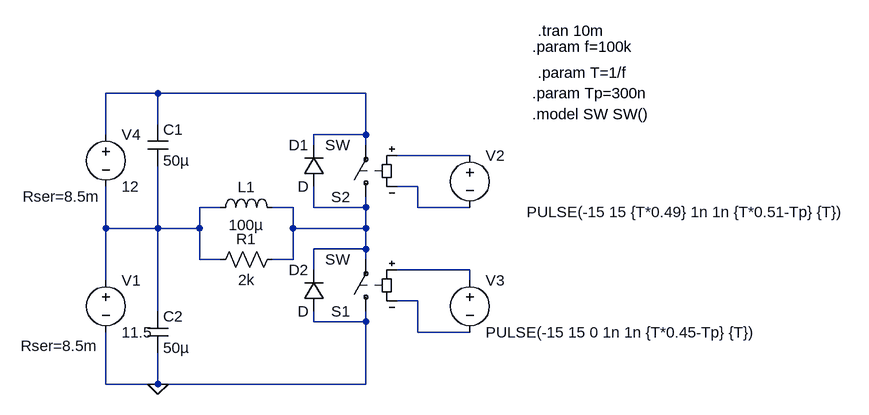
[diagram p0: schematic Draft1.asc]
Draft1.asc, the LTspice schematic file:
Version 4
SHEET 1 1116 680
WIRE -16 -64 -96 -64
WIRE 304 -64 -16 -64
WIRE -16 -16 -16 -64
WIRE -96 0 -96 -64
WIRE 304 0 304 -64
WIRE 304 0 224 0
WIRE 224 16 224 0
WIRE 304 16 304 0
WIRE 464 32 352 32
WIRE 384 80 352 80
WIRE 80 112 48 112
WIRE 192 112 160 112
WIRE 224 112 224 80
WIRE 304 112 304 96
WIRE 304 112 224 112
WIRE 384 112 384 80
WIRE 464 112 384 112
WIRE -96 144 -96 80
WIRE -16 144 -16 48
WIRE -16 144 -96 144
WIRE 48 144 48 112
WIRE 48 144 -16 144
WIRE 192 144 192 112
WIRE 304 144 304 112
WIRE 304 144 192 144
WIRE 304 176 304 144
WIRE 304 176 224 176
WIRE 48 192 48 144
WIRE 80 192 48 192
WIRE 192 192 192 144
WIRE 192 192 160 192
WIRE 304 192 304 176
WIRE 224 208 224 176
WIRE 464 208 352 208
WIRE -96 224 -96 144
WIRE 464 224 464 208
WIRE 384 256 352 256
WIRE -16 272 -16 144
WIRE 224 288 224 272
WIRE 304 288 304 272
WIRE 304 288 224 288
WIRE 384 304 384 256
WIRE 464 304 384 304
WIRE -96 384 -96 304
WIRE -16 384 -16 336
WIRE -16 384 -96 384
WIRE 304 384 304 288
WIRE 304 384 -16 384
FLAG -16 384 0
SYMBOL ind 64 128 R270
WINDOW 0 32 56 VTop 2
WINDOW 3 5 56 VBottom 2
SYMATTR InstName L1
SYMATTR Value 100µ
SYMBOL res 176 176 R90
WINDOW 0 0 56 VBottom 2
WINDOW 3 32 56 VTop 2
SYMATTR InstName R1
SYMATTR Value 2k
SYMBOL cap -32 -16 R0
SYMATTR InstName C1
SYMATTR Value 50µ
SYMBOL cap -32 272 R0
SYMATTR InstName C2
SYMATTR Value 50µ
SYMBOL voltage -96 208 R0
WINDOW 123 0 0 Left 0
WINDOW 39 -131 117 Left 2
SYMATTR SpiceLine Rser=8.5m
SYMATTR InstName V1
SYMATTR Value 11.5
SYMBOL voltage 464 16 R0
WINDOW 123 0 0 Left 0
WINDOW 39 0 0 Left 0
WINDOW 3 87 103 Left 2
SYMATTR Value PULSE(-15 15 {T*0.49} 1n 1n {T*0.51-Tp} {T})
SYMATTR InstName V2
SYMBOL voltage 464 208 R0
WINDOW 123 0 0 Left 0
WINDOW 39 0 0 Left 0
SYMATTR InstName V3
SYMATTR Value PULSE(-15 15 0 1n 1n {T*0.45-Tp} {T})
SYMBOL voltage -96 -16 R0
WINDOW 123 0 0 Left 0
WINDOW 39 -128 111 Left 2
SYMATTR SpiceLine Rser=8.5m
SYMATTR InstName V4
SYMATTR Value 12
SYMBOL sw 304 288 R180
SYMATTR InstName S1
SYMBOL sw 304 112 R180
SYMATTR InstName S2
SYMBOL diode 240 80 R180
WINDOW 0 24 64 Left 2
WINDOW 3 24 0 Left 2
SYMATTR InstName D1
SYMBOL diode 240 272 R180
WINDOW 0 24 64 Left 2
WINDOW 3 24 0 Left 2
SYMATTR InstName D2
TEXT 560 -64 Left 2 !.param Tp=300n
TEXT 560 -32 Left 2 !.model SW SW()
TEXT 560 -136 Left 2 !.param f=100k
TEXT 568 -96 Left 2 !.param T=1/f
TEXT 568 -160 Left 2 !.tran 10m

The netlist it stands for:
* Draft1.asc
L1 N004 N005 100µ
R1 N005 N004 2k
C1 N001 N004 50µ
C2 N004 0 50µ
V1 N004 0 11.5 Rser=8.5m
V2 N002 N003 PULSE(-15 15 {T*0.49} 1n 1n {T*0.51-Tp} {T})
V3 N006 N007 PULSE(-15 15 0 1n 1n {T*0.45-Tp} {T})
V4 N001 N004 12 Rser=8.5m
S1 0 N005 N006 N007 SW
S2 N005 N001 N002 N003 SW
D1 N005 N001 D
D2 0 N005 D
.model D D
.lib standard.dio
.param Tp=300n
.model SW SW()
.param f=100k
.param T=1/f
.tran 10m
.backanno
.end